# Altium schematic sheet MCU.SchDoc
size A4; SheetNumber: 4; SheetTotal: 4
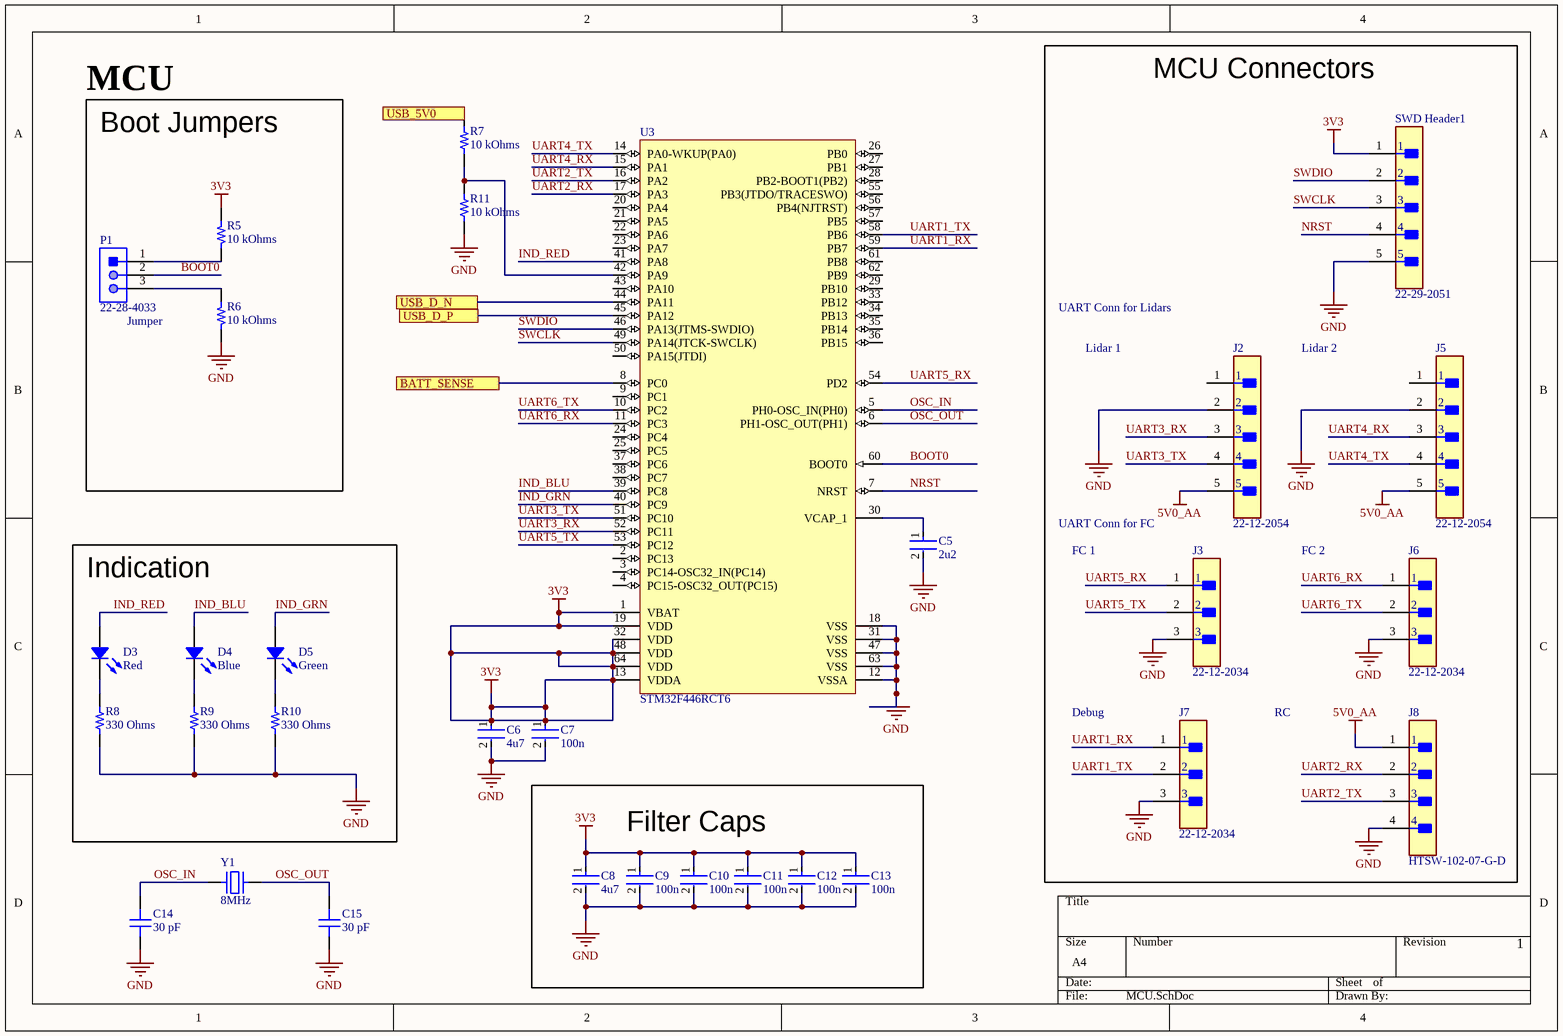
[diagram p0: MCU.SchDoc]

## Parts
C5  2u2  [FP-CL10-IPC_C]
C6  4u7  [FP-CL10-IPC_C]
C7  100n  [FP-CL779-IPC_C]
C8  4u7  [FP-CL10-IPC_C]
C9  100n  [FP-CL779-IPC_C]
C10  100n  [FP-CL779-IPC_C]
C11  100n  [FP-CL779-IPC_C]
C12  100n  [FP-CL779-IPC_C]
C13  100n  [FP-CL779-IPC_C]
C14  30 pF  [CAP 0603_1608]
C15  30 pF  [CAP 0603_1608]
D3  Red  [LED 0603_1608 RED]
D4  Blue  [LED 0603_1608 BLUE]
D5  Green  [LED 0603_1608 GREEN]
J2  22-12-2054  [FP-22-12-2054-MFG]
J3  22-12-2034  [FP-22-12-2034-MFG]
J5  22-12-2054  [FP-22-12-2054-MFG]
J6  22-12-2034  [FP-22-12-2034-MFG]
J7  22-12-2034  [FP-22-12-2034-MFG]
J8  HTSW-102-07-G-D  [FP-HTSW-102-07-G-D-MFG]
P1  22-28-4033  [MOLX-22-28-4033_V]
R5  10 kOhms  [RES 0603_1608]
R6  10 kOhms  [RES 0603_1608]
R7  10 kOhms  [RES 0603_1608]
R8  330 Ohms  [RES 0603_1608]
R9  330 Ohms  [RES 0603_1608]
R10  330 Ohms  [RES 0603_1608]
R11  10 kOhms  [RES 0603_1608]
SWD_Header1  22-29-2051  [FP-22-29-2051-MFG]
U3  STM32F446RCT6  [STM-LQFP64_L]
Y1  8MHz  [TXC 9C]

## Blocks framed on the sheet
MCU Connectors: J2 J3 J5-J8 SWD_Header1
MCU: P1 R5 R6
Indication: D3-D5 R8-R10
Filter Caps: C8-C13

## Ports
BATT_SENSE, USB_5V0, USB_D_N, USB_D_P

## Nets
3V3: C6.1 C7.1 C8.1 C9.1 C10.1 C11.1 C12.1 C13.1 R5.1 SWD_Header1.1 U3.1(VBAT) U3.13(VDDA) U3.19(VDD) U3.32(VDD) U3.48(VDD) U3.64(VDD)
5V0_AA: J2.5 J5.5 J8.1
GND: C5.2 C6.2 C7.2 C8.2 C9.2 C10.2 C11.2 C12.2 C13.2 C14.1 C15.1 J2.2 J3.3 J5.2 J6.3 J7.3 J8.4 R6.1 R8.1 R9.1 R10.1 R11.1 SWD_Header1.5 U3.12(VSSA) U3.18(VSS) U3.31(VSS) U3.47(VSS) U3.63(VSS)
BATT_SENSE: U3.8(PC0) ; port BATT_SENSE
BOOT0: P1.2 U3.60(BOOT0)
IND_BLU: D4.1 U3.39(PC8)
IND_GRN: D5.1 U3.40(PC9)
IND_RED: D3.1 U3.41(PA8)
NRST: SWD_Header1.4 U3.7(NRST)
OSC_IN: C14.2 U3.5(PH0-OSC_IN(PH0)) Y1.1
OSC_OUT: C15.2 U3.6(PH1-OSC_OUT(PH1)) Y1.2
SWCLK: SWD_Header1.3 U3.49(PA14(JTCK-SWCLK))
SWDIO: SWD_Header1.2 U3.46(PA13(JTMS-SWDIO))
UART1_RX: J7.1 U3.59(PB7)
UART1_TX: J7.2 U3.58(PB6)
UART2_RX: J8.2 U3.17(PA3)
UART2_TX: J8.3 U3.16(PA2)
UART3_RX: J2.3 U3.52(PC11)
UART3_TX: J2.4 U3.51(PC10)
UART4_RX: J5.3 U3.15(PA1)
UART4_TX: J5.4 U3.14(PA0-WKUP(PA0))
UART5_RX: J3.1 U3.54(PD2)
UART5_TX: J3.2 U3.53(PC12)
UART6_RX: J6.1 U3.11(PC3)
UART6_TX: J6.2 U3.10(PC2)
USB_5V0: R7.2 ; port USB_5V0
USB_D_N: U3.44(PA11) ; port USB_D_N
USB_D_P: U3.45(PA12) ; port USB_D_P
NetC5_1: C5.1 U3.30(VCAP_1)
NetD3_2: D3.2 R8.2
NetD4_2: D4.2 R9.2
NetD5_2: D5.2 R10.2
NetP1_1: P1.1 R5.2
NetP1_3: P1.3 R6.2
NetR7_1: R7.1 R11.2 U3.42(PA9)

Not connected (* = marked no-connect by the designer): J2 1; J5 1; U3 2(PC13) 3(PC14-OSC32_IN(PC14)) 4(PC15-OSC32_OUT(PC15)) 9(PC1) 20(PA4) 21(PA5) 22(PA6) 23(PA7) 24(PC4) 25(PC5) 26(PB0) 27(PB1) 28(PB2-BOOT1(PB2)) 29(PB10) 33(PB12) 34(PB13) 35(PB14) 36(PB15) 37(PC6) 38(PC7) 43(PA10) 50(PA15(JTDI)) 55(PB3(JTDO/TRACESWO)) 56(PB4(NJTRST)) 57(PB5) 61(PB8) 62(PB9)

## Notes on the sheet
- Boot Jumpers
- UART Conn for Lidars
- (near P1) Jumper
- Lidar 1
- Lidar 2
- UART Conn for FC
- FC 1
- FC 2
- Debug
- RC
- 1

## Library data of the parts
C5 C6 C8 = CMP-13271-003017-1: Cap Ceramic 4.7uF 10V X5R ±10% Pad SMD 0603 +85°C T/R; Capacitance: 4.7uF; Case/Package: 0603; Packaging: Tape and Reel; Width: 0.031inch; Contact Plating: Tin; Thickness: 0.035inch; Package Quantity: 1; Voltage Rating: 10V; Case Code (Metric): 1608; Case Code (Imperial): 0603; Depth: 0.8mm; Height: 0.8mm; Tolerance: 10%; Max Operating Temperature: 85°C; Length: 1.6mm; Dielectric: X5R; Mount: Surface Mount; Radiation Hardening: No; Min Operating Temperature: -55°C
C7 C9-C13 = CMP-13271-002336-1: Cap Ceramic 100nF 50V X7R ±10% SMD 0402 +125°C Paper T/R
C14 C15 = 0603N300J500CT: CAP CER 30PF 50V C0G/NP0 0603; manufacturer: Walsin Technology Corporation; Temperature Coefficient: C0G, NP0; Tolerance: ±5%; Part Number: 0603N300J500CT; Value: 30 pF; Applications: General Purpose; Capacitance: 30 pF; componentlink1description: Datasheet; componentlink1url: http://www.passivecomponent.com/wp-content/uploads/2018/10/MLCC.pdf; componentlink2description: DigiKey Link; componentlink2url: https://www.digikey.com/en/products/detail/walsin-technology-corporation/0603N300J500CT/9355012; Device Package: 0603 (1608 Metric); lastupdated: 2/9/2024 8:10:20 PM; Lifecycle Status: Active; Minimum Order: 1; Mounting Type: Surface Mount, MLCC; Operating Temperature: -55°C ~ 125°C; Package / Case: 0603 (1608 Metric); packaging: TapeAndReel; partid: 9974; Part Status: Active; price: 0.01; series: -; Size / Dimension: 0.063" L x 0.031" W (1.60mm x 0.80mm); Supplier 1: DigiKey; Supplier Part Number 1: 1292-1515-1-ND; Thickness (Max): 0.034" (0.87mm); Voltage - Rated: 50V
D3 = 19-213SDRC/S259/TR8: LED RED CLEAR 2SMD; Manufacturer: Everlight Electronics Co Ltd; Configuration: Standard; Current - Test: 10mA; Lens Color: Colorless; Lens Size: 1.20mm x 0.80mm; Lens Style: Rectangle with Flat Top; Viewing Angle: 120°; Voltage - Forward (Vf) (Typ): 2V; Wavelength - Peak: 650nm; Part Number: 19-213SDRC/S259/TR8; Color: Red; ComponentLink1Description: Datasheet; ComponentLink1URL: //media.digikey.com/pdf/Data%20Sheets/Everlight%20PDFs/19-213SDRC-S259-TR8.pdf; ComponentLink2Description: DigiKey Link; ComponentLink2URL: http://digikey.com/product-detail/en/everlight-electronics-co-ltd/19-213SDRC-S259-TR8/1080-1580-1-ND/8535303; Device Package: 0603 (1608 Metric); Height (Max): 0.70mm; LastUpdated: 6/3/2024 7:59:48 PM; Lens Transparency: Clear; Lifecycle Status: Active; Minimum Order: 1; Mounting Type: Surface Mount; Package / Case: 0603 (1608 Metric); Packaging: TapeAndReel; PartId: 372; Part Status: Active; Price: 0.06; Series: -; Size / Dimension: 1.60mm L x 0.80mm W; Supplier 1: DigiKey; Supplier Part Number 1: 1080-1580-1-ND; Supplier Device Package: 2-SMD; Value: Red
D4 = 19-213SUBC/S400-A5/S208-2/TR8: LED BLUE CLEAR 2SMD; Manufacturer: Everlight Electronics Co Ltd; Configuration: Standard; Current - Test: 5mA; Lens Color: Colorless; Lens Size: 1.20mm x 0.80mm; Lens Style: Rectangle with Flat Top; Viewing Angle: 120°; Voltage - Forward (Vf) (Typ): 2.9V; Wavelength - Peak: 468nm; Part Number: 19-213SUBC/S400-A5/S208-2/TR8; Color: Blue; ComponentLink1Description: Datasheet; ComponentLink1URL: //media.digikey.com/pdf/Data%20Sheets/Everlight%20PDFs/19-213SUBC-S400-A5-S208-2-TR8.pdf; ComponentLink2Description: DigiKey Link; ComponentLink2URL: https://www.digikey.com/en/products/detail/everlight-electronics-co-ltd/19-213SUBC-S400-A5-S208-2-TR8/8535275; Device Package: 0603 (1608 Metric); Height (Max): 0.70mm; LastUpdated: 6/3/2024 7:57:52 PM; Lens Transparency: Clear; Lifecycle Status: Active; Minimum Order: 1; Mounting Type: Surface Mount; Package / Case: 0603 (1608 Metric); Packaging: TapeAndReel; PartId: 808; Part Status: Active; Price: 0.05; Series: -; Size / Dimension: 1.60mm L x 0.80mm W; Supplier 1: DigiKey; Supplier Part Number 1: 1080-1581-1-ND; Supplier Device Package: 2-SMD; Value: Blue
D5 = 150060GS55040: LED GREEN DIFFUSED 0603 SMD; Manufacturer: Würth Elektronik; Configuration: Standard; Current - Test: 20mA; Lens Color: 0.50mm; Lens Size: 1.00mm x 0.80mm; Lens Style: Rectangle with Flat Top; Millicandela Rating: 430mcd; Viewing Angle: 140°; Voltage - Forward (Vf) (Typ): 3.2V; Wavelength - Dominant: 525nm; Wavelength - Peak: 520nm; Part Number: 150060GS55040; Color: Green; ComponentLink1Description: Datasheet; ComponentLink1URL: https://www.we-online.de/web/en/index.php/download/media/07_electronic_components/download_center_1/application_notes_berichte/ano002_leds___the_future_of_horticultural_lighting/ANO002b_EN_LEDs_The_Future_of_Horticultural_Lighting.pdf; ComponentLink2Description: DigiKey Link; ComponentLink2URL: https://www.digikey.com/en/products/detail/würth-elektronik/150060GS55040/8557179; Device Package: 0603 (1608 Metric); Height (Max): 0.50mm; LastUpdated: 6/3/2024 7:58:52 PM; Lens Transparency: Diffused; Lifecycle Status: Active; Minimum Order: 1; Mounting Type: Surface Mount; Package / Case: 0603 (1608 Metric); Packaging: TapeAndReel; PartId: 673; Part Status: Active; Price: 0.14; Series: WL-SMCD; Size / Dimension: 1.60mm L x 0.80mm W; Supplier 1: DigiKey; Supplier Part Number 1: 732-12014-1-ND; Supplier Device Package: 0603 (1608 Metric); Value: Green
J2 J5 = CMP-00257-00024825-1: 22-12-2054 KK® 254 Solid Header, Right Angle, with Friction Lock, 5 Circuits, 0.51µm Gold (Au) Plating; NexarPartId: 24825; Contact Resistance: 10mΩ; Voltage Rating: 250V; Pitch: 2.54mm; Current Rating: 4A; Number of Circuits: 5; Approvals: CSA, UL; Insulation Resistance: 50GΩ; Glow Wire Compliant: Non-compliant; Gender: Male; Termination: Through Hole; Max Operating Temperature: 75°C; RoHS: Compliant; Orientation: Right Angle; Color: White; Housing Material: Nylon; Lead Pitch: 2.54mm; Halogen Free: Low Halogen; Packaging: Bulk; Voltage Rating (DC): 250V; Number of Contacts: 5; Lead Free: Contains Lead; Contact Plating: Gold; Flammability Rating: UL94 V-0; Radiation Hardening: No; Number of Positions: 5; Min Operating Temperature: 0°C; Housing Color: White; REACH SVHC: Unknown; Schedule B: 8536694040; Number of Rows: 1; Mount: Through Hole; Contact Material: Brass
J3 J6 J7 = CMP-04776-000587-1: CONN HEADER R/A 3POS 2.54MM; Approvals: UL; Contact Resistance: 10mR; Connector Type: Male Pin; Number of Circuits: 3; Voltage Rating: 250V; Gender: Male; Current Rating: 4A; Max Current Rating: 3A; Pitch: 2.54mm; RoHS Compliant: Yes; Contact Type: Male Pin; Housing Color: White; Orientation: Right Angle; Min Operating Temperature: 0°C; Depth: 12.83mm; Flammability Rating: UL94 V-0; Height: 2.03mm; Max Operating Temperature: 75°C; Number of Contacts: 3; Mount: Through Hole; Housing Material: Nylon; Number of Positions: 3; Series: KK® 7478; Max Voltage Rating (AC): 250V; Packaging: Bulk; Radiation Hardening: No; Length: 7.62mm; Contact Plating: Gold; Fastening Type: Friction; Contact Material: Brass; Color: White; Contact Mating Length: 0.264inch; Termination: Solder; Number of Rows: 1
J8 = CMP-02766-000010-1: CONN HEADER VERT 4POS 2.54MM; Manufacturer: Samtec; Voltage Rating: 550V; Conn Orientation: Straight; Number Of Contacts: 4; Description: Connector Header Through Hole 4 position 0.100" (2.54mm); Conn Gender: Male; Current Rating: 6.3A; Number Of Rows: 2; Category: Conn; Temperature: -55°C to +125°C; Automotive: No; Digikey Description: CONN HEADER VERT 4POS 2.54MM; ComponentLink2URL: http://suddendocs.samtec.com/catalog_english/htsw_th.pdf; Device Class L2: Headers and Wire Housings; Mouser Description: Conn Unshrouded Header HDR 4 POS 2.54mm Solder ST Thru-Hole Bag; Manufacturer Part Number: HTSW-102-07-G-D; Temperature Range High: +125°C; Contact Material: Gold,Nickel; Temperature Range Low: -55°C; ComponentLink2Description: Datasheet; Device Class L1: Connectors; Pitch: 2.54mm; Octopart: https://octopart.com/htsw-102-07-g-d-samtec-10531767; RoHS: TRUE; Package: HTSW-102-07-G-D; Lead Free: Yes; Device Class L3: unset; Height: 8.71mm
P1 = CMP-1676-00001-5: Male Header, Pitch 2.54 mm, 1 x 3 Position, Height 8.38 mm, Tail Length 3.18 mm, RoHS, Bulk; Manufacturer: Molex; Rows: 1; Voltage Rating: 250 V; Current Rating: 4 A; Min Operating Temperature: 0 degC; Lead Pitch: 0.1 inch; Packaging: Bulk; Contact Finish: Gold; RoHSCompliant: true; Contact Material: Brass; PackageReference: 22-28-4033; REACH SVHC: Unknown; PackageDescription: Male Header, Pitch 2.54 mm, 1 x 3 Position, Height 8.38 mm, Tail Length 3.18 mm; ComponentLink2URL: http://www.molex.com/pdm_docs/sd/022284033_sd.pdf; Height: 8.38 mm; Mounting Technology: Through Hole; ComponentLink1Description: Manufacturer URL; Length: 7.62 mm; Mount: Through Hole; DatasheetVersion: Rev. G, 01/2012; Max Operating Temperature: 75 degC; ComponentLink2Description: Datasheet; Colour: Black; Pins: 3; Contact Plating: Gold; Package Quantity: 1; ComponentLink1URL: http://www.molex.com/
R5 R6 = P2TC0603D1002LNTA: P2TC0603 2PPM/C 10K 0,01% N TA; Manufacturer: Vishay Sfernice; Power (Watts): 0.125W, 1/8W; Temperature Coefficient: ±2ppm/°C; Tolerance: ±0.01%; Part Number: P2TC0603D1002LNTA; Value: 10 kOhms; ComponentLink1Description: Datasheet; ComponentLink1URL: https://www.vishay.com/docs/53080/p2tc.pdf; ComponentLink2Description: DigiKey Link; ComponentLink2URL: https://www.digikey.com/en/products/detail/vishay-sfernice/P2TC0603D1002LNTA/11657673; Composition: Thin Film; Device Package: 0603 (1608 Metric); Features: Anti-Sulfur, Moisture Resistant; Height - Seated (Max): 0.025" (0.63mm); LastUpdated: 2/9/2024 8:41:20 PM; Lifecycle Status: Active; Minimum Order: 1; Number of Terminations: 2; Operating Temperature: -55°C ~ 155°C; Package / Case: 0603 (1608 Metric); Packaging: TapeAndReel; PartId: 62108; Part Status: Active; Price: 11.51; Resistance: 10 kOhms; Series: P2TC; Size / Dimension: 0.060" L x 0.033" W (1.52mm x 0.85mm); Supplier 1: DigiKey; Supplier Part Number 1: 716-P2TC0603D1002LNTACT-ND; Supplier Device Package: 0603
R7 R11 = APC0603B10K0N: 1/16 WATTS PRECISION CHIP 10 KIL; Manufacturer: Ohmite; Power (Watts): 0.063W, 1/16W; Temperature Coefficient: ±25ppm/°C; Tolerance: ±0.1%; Part Number: APC0603B10K0N; Value: 10 kOhms; ComponentLink1Description: Datasheet; ComponentLink1URL: https://www.ohmite.com/assets/docs/APC-1-15.34.pdf; ComponentLink2Description: DigiKey Link; ComponentLink2URL: https://www.digikey.com/en/products/detail/ohmite/APC0603B10K0N/16369646; Composition: Thin Film; Device Package: 0603 (1608 Metric); Height - Seated (Max): 0.022" (0.55mm); LastUpdated: 2/9/2024 8:40:41 PM; Lifecycle Status: Active; Minimum Order: 1; Number of Terminations: 2; Operating Temperature: -55°C ~ 155°C; Package / Case: 0603 (1608 Metric); Packaging: TapeAndReel; PartId: 77923; Part Status: Active; Price: 0.05; Resistance: 10 kOhms; Series: APC; Size / Dimension: 0.061" L x 0.031" W (1.55mm x 0.80mm); Supplier 1: DigiKey; Supplier Part Number 1: 273-APC0603B10K0NCT-ND; Supplier Device Package: 0603
R8-R10 = RCC0603330RFKEA: RCC0603 100 330R 1% ET1 E3; Manufacturer: Vishay Dale; Power (Watts): 0.2W, 1/5W; Temperature Coefficient: ±100ppm/°C; Part Number: RCC0603330RFKEA; Value: 330 Ohms; ComponentLink1Description: Datasheet; ComponentLink1URL: https://www.vishay.com/docs/20066/rcce3.pdf; ComponentLink2Description: DigiKey Link; ComponentLink2URL: https://www.digikey.com/en/products/detail/vishay-dale/RCC0603330RFKEA/12084212; Composition: Thick Film; Device Package: 0603 (1608 Metric); Features: Automotive AEC-Q200; Height - Seated (Max): 0.020" (0.50mm); LastUpdated: 2/9/2024 8:41:26 PM; Lifecycle Status: Active; Minimum Order: 1; Number of Terminations: 2; Operating Temperature: -55°C ~ 155°C; Package / Case: 0603 (1608 Metric); Packaging: TapeAndReel; PartId: 62920; Part Status: Active; Price: 0.01; Ratings: AEC-Q200; Resistance: 330 Ohms; Series: RCC e3; Size / Dimension: 0.061" L x 0.033" W (1.55mm x 0.85mm); Supplier 1: DigiKey; Supplier Part Number 1: 541-RCC0603330RFKEACT-ND; Supplier Device Package: 0603; Tolerance: ±1%
SWD_Header1 = CMP-04776-000816-1: 2.54MM KK HDR VT FRICLK VRA .5AU; Number of Circuits: 5; Connector Type: Male Pin; Max Current Rating: 7A; Glow Wire Compliant: Non-compliant; Insulation Resistance: 50GR; Gender: Male; Current Rating: 4A; Number of Lines: 1; Max Voltage Rating (AC): 250V; Contact Resistance: 10mR; Orientation: Straight; Height: 14.73mm; Contact Plating: Gold; Series: KK® 6410; Number of Poles: 5; Mount: Through Hole; Length: 12.7mm; Packaging: Bulk; Package Quantity: 10; Depth: 5.8mm; Housing Color: White; Pitch: 2.54mm; Number of Positions: 5; Contact Mating Length: 0.295inch; Max Operating Temperature: 75°C; Housing Material: Nylon; Termination: Solder; Contact Material: Brass; Flammability Rating: UL94 V-0; Number of Contacts: 5; Color: Natural; Min Operating Temperature: 0°C; Radiation Hardening: No; Contact Type: Male Pin; Number of Rows: 1; Voltage Rating: 250V; Voltage Rating (DC): 250V; Contact Gender: Male; Fastening Type: Friction; Lead Free: Lead Free; Halogen Free: Low Halogen
U3 = CMP-0243-00216-1: ARM Cortex-M4 32-bit MCU+FPU, 256 KB Flash, 128 KB Internal RAM, 50 I/Os, 64-Pin LQFP, -40 to 85 degC, Tray; Operating Frequency(F) (Processor speed) (MHz): 180; Internal RAM Size (kB): 128; I/Os (High Current): 50; FLASH Size (Prog) (kB): 256; D/A Converter: 2; Supply Voltage(Vcc) min (V): 1.7; Mounting Technology: Surface Mount; DatasheetVersion: Rev. 6; ComponentLink1URL: http://www.st.com/; Package Description: LQFP64; ComponentLink1Description: Manufacturer URL; Packing: Tray; ComponentLink2Description: Datasheet; Core: ARM Cortex-M4; Package Reference: 64-Pin Low-profile Quad Flat Package, Body 10 x 10 mm, Pitch 0.5 mm; ComponentLink2URL: http://www.st.com/st-web-ui/static/active/en/resource/technical/document/datasheet/DM00141306.pdf
Y1 = 9C-8.000MBBK-T: CRYSTAL 8.0000MHZ 20PF SMD; Manufacturer: TXC CORPORATION; ESR (Equivalent Series Resistance): 80 Ohms; Frequency Stability: ±50ppm; Operating Mode: Fundamental; Part Number: 9C-8.000MBBK-T; ComponentLink1Description: Datasheet; ComponentLink1URL: http://www.txccorp.com/download/products/quartz_crystals/2015TXC_9C_32.pdf; ComponentLink2Description: DigiKey Link; ComponentLink2URL: http://digikey.com/product-detail/en/txc-corporation/9C-8.000MBBK-T/887-2475-1-ND/4475454; Frequency: 8MHz; Frequency Tolerance: ±50ppm; Height - Seated (Max): 0.161" (4.10mm); LastUpdated: 6/3/2024 8:02:24 PM; Lifecycle Status: Active; Load Capacitance: 20pF; Minimum Order: 1; Mounting Type: Surface Mount; Operating Temperature: -20°C ~ 70°C; Package / Case: HC-49S; Packaging: TapeAndReel; PartId: 697; Part Status: Active; Price: 0.18; Series: 9C; Size / Dimension: 0.449" L x 0.189" W (11.40mm x 4.80mm); Supplier 1: DigiKey; Supplier Part Number 1: 887-2475-1-ND; Type: MHz Crystal; Value: 8MHz